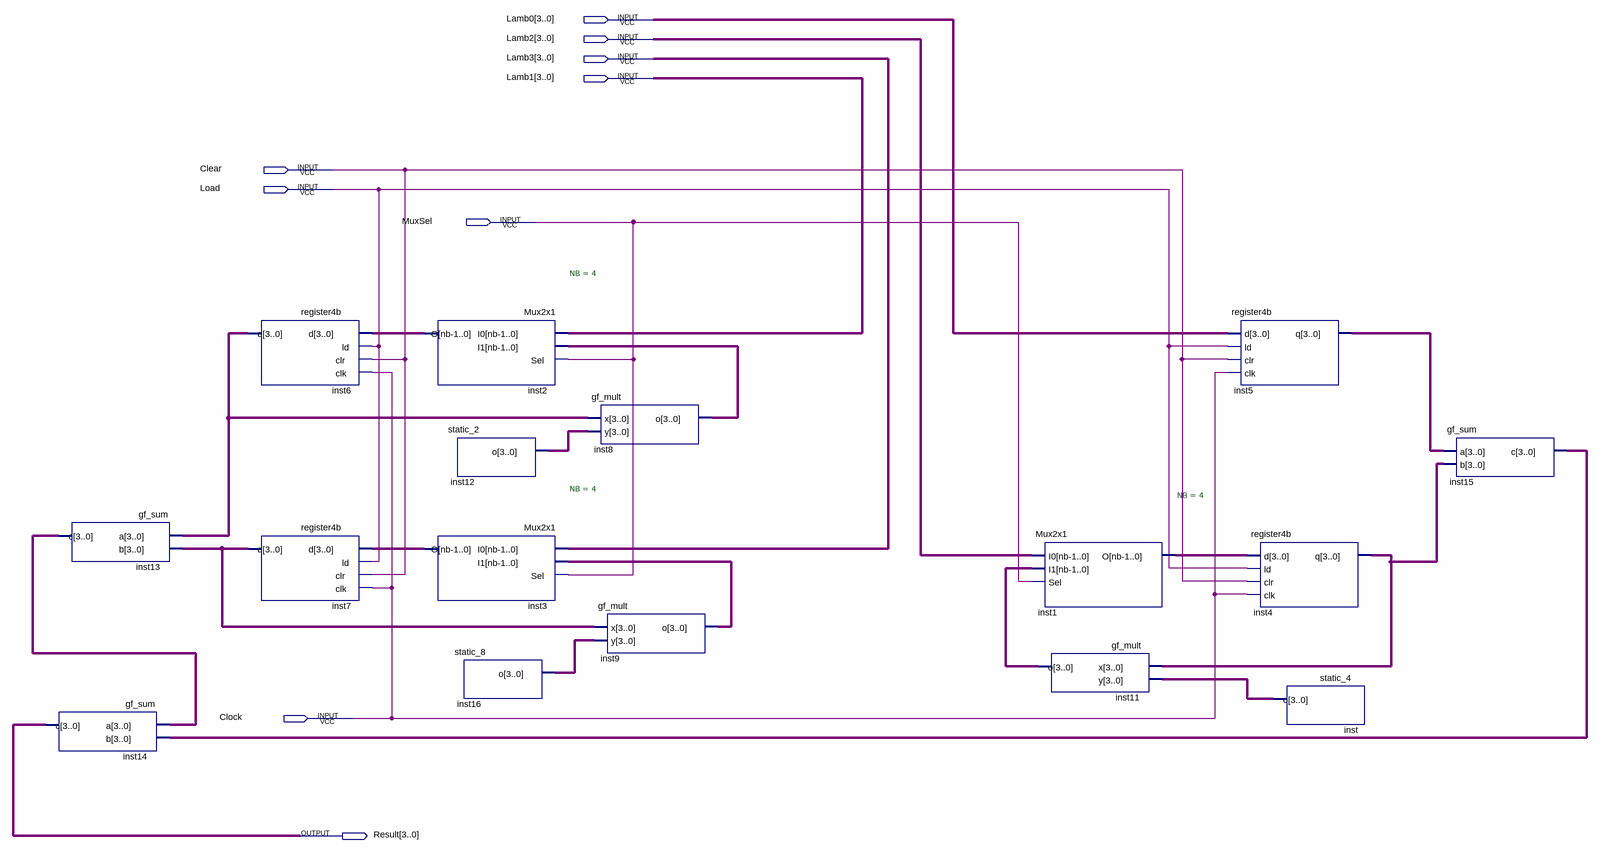
[diagram p0: schematic sheet]
// Quartus schematic Chien Search value.bdf as structural Verilog: 16 symbols, 9 pins
module \Chien_Search_value  (
  input  [3:0] Lamb0,
  input  [3:0] Lamb2,
  input  [3:0] Lamb3,
  input  [3:0] Lamb1,
  input  Clear,
  input  Load,
  input  MuxSel,
  input  Clock,
  output [3:0] Result
);

  wire [3:0] inst1_o, inst2_o, inst3_o, inst4_q, inst5_q, inst6_q, inst7_q, inst8_o, inst9_o, inst11_o,
       inst12_o, inst13_c, inst15_c, inst16_o, inst_o;

  gf_sum inst13 (.a(inst6_q), .b(inst7_q), .c(inst13_c));
  gf_sum inst14 (.a(inst13_c), .b(inst15_c), .c(Result));
  register4b inst6 (.d(inst2_o), .ld(Load), .clr(Clear), .clk(Clock), .q(inst6_q));
  register4b inst7 (.d(inst3_o), .ld(Load), .clr(Clear), .clk(Clock), .q(inst7_q));
  Mux2x1 #(.NB(4)) inst2 (.I0(Lamb1), .I1(inst8_o), .Sel(MuxSel), .O(inst2_o));
  Mux2x1 #(.NB(4)) inst3 (.I0(Lamb3), .I1(inst9_o), .Sel(MuxSel), .O(inst3_o));
  static_2 inst12 (.o(inst12_o));
  static_8 inst16 (.o(inst16_o));
  gf_mult inst8 (.x(inst6_q), .y(inst12_o), .o(inst8_o));
  gf_mult inst9 (.x(inst7_q), .y(inst16_o), .o(inst9_o));
  Mux2x1 #(.NB(4)) inst1 (.I0(Lamb2), .I1(inst11_o), .Sel(MuxSel), .O(inst1_o));
  gf_mult inst11 (.x(inst4_q), .y(inst_o), .o(inst11_o));
  register4b inst5 (.d(Lamb0), .ld(Load), .clr(Clear), .clk(Clock), .q(inst5_q));
  register4b inst4 (.d(inst1_o), .ld(Load), .clr(Clear), .clk(Clock), .q(inst4_q));
  static_4 inst (.o(inst_o));
  gf_sum inst15 (.a(inst5_q), .b(inst4_q), .c(inst15_c));
endmodule
